# EAGLE schematic canable_candapter (EAGLE 9.4.2)
Therm
CNAME: CANable USB<=>CAN; CREVISION: 0.1; DESIGNER: Ethan Zonca
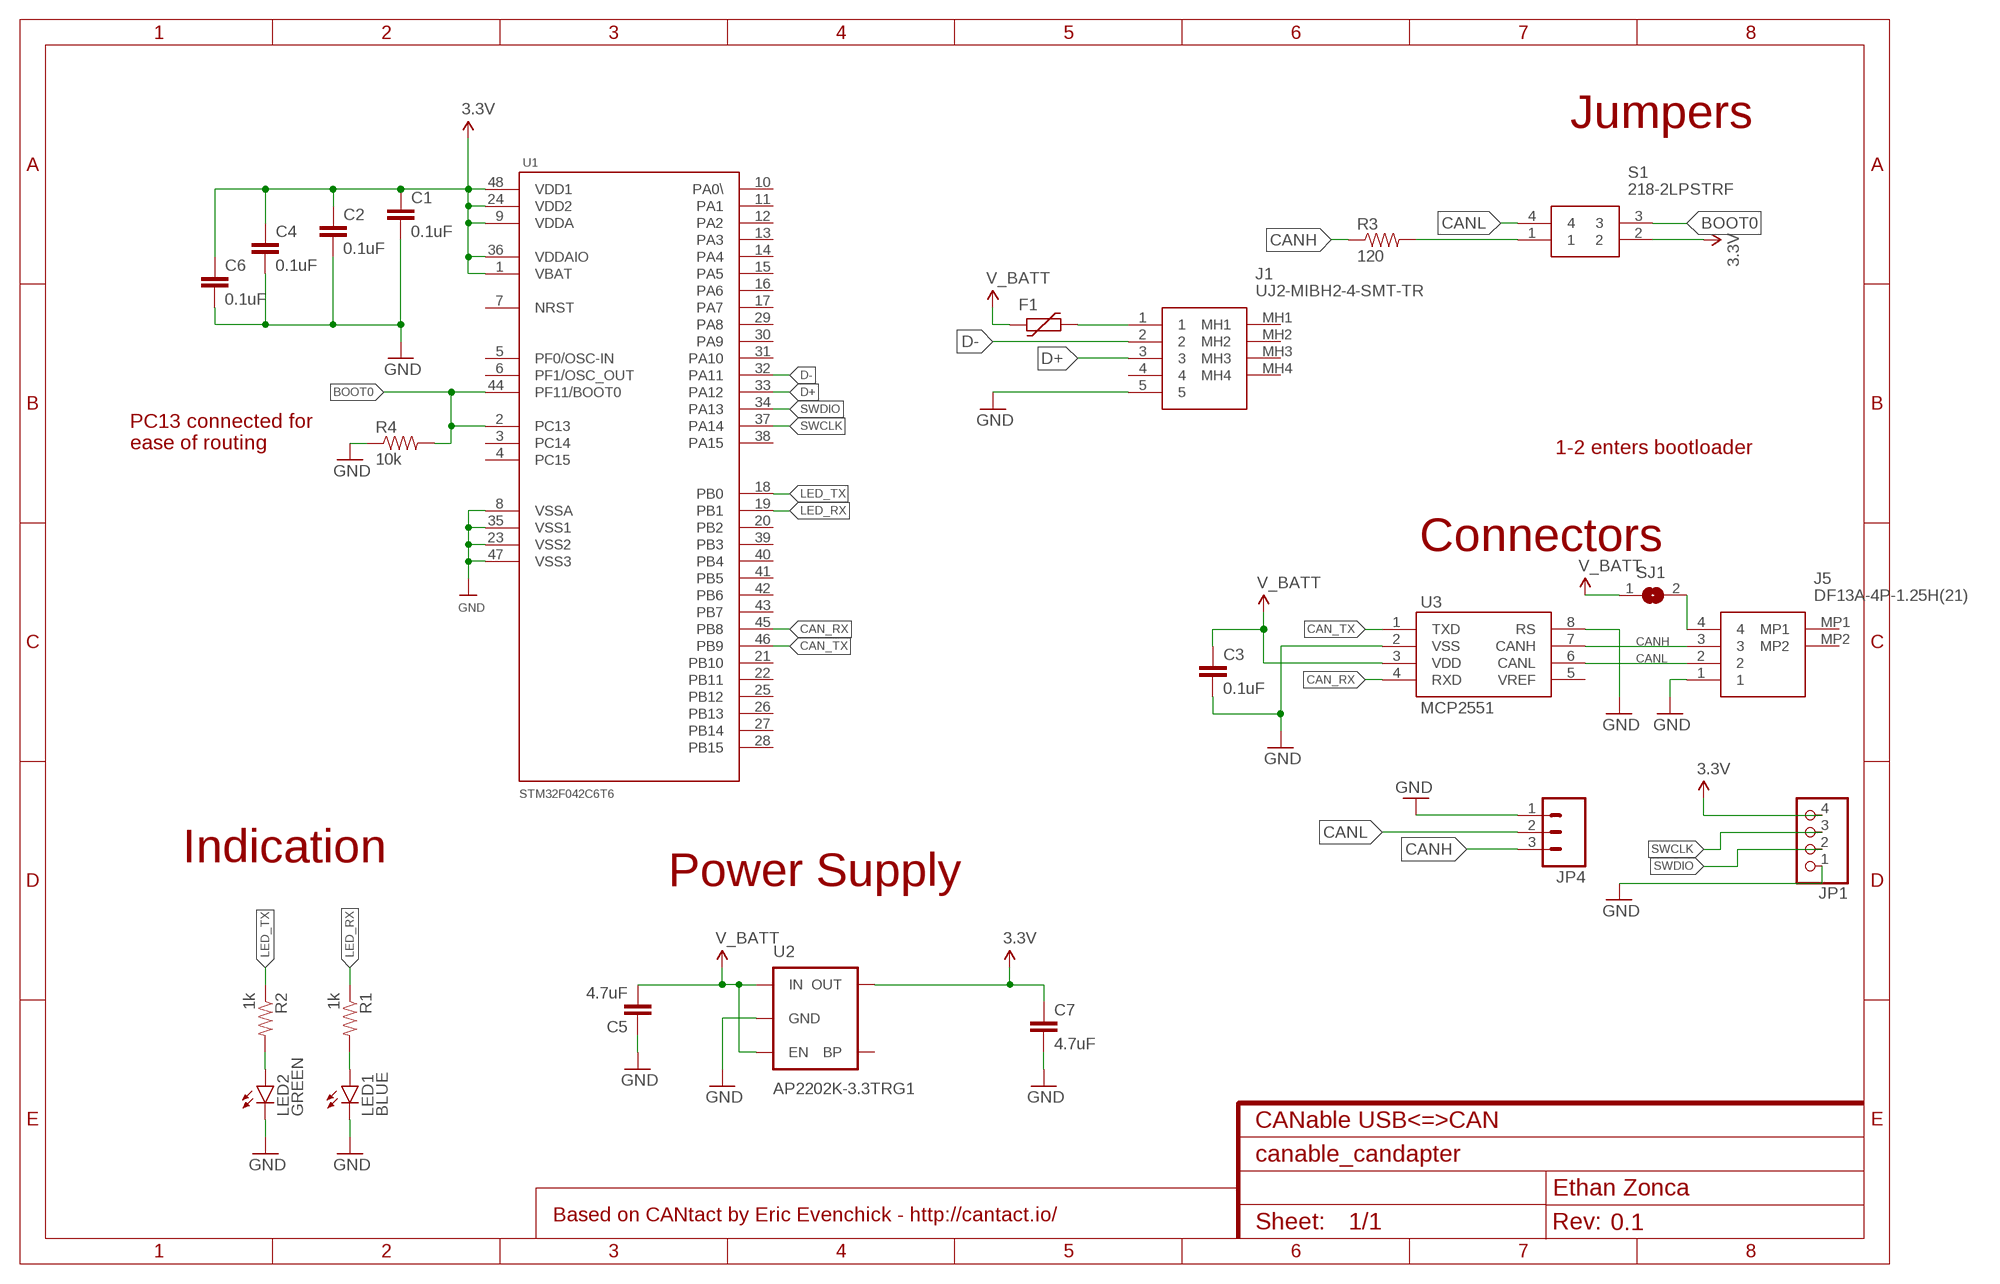
[diagram p0: schematic, sheet 1]

## Parts
C1  0.1uF  CAP0603-CAP  [0603-CAP]
C2  0.1uF  CAP0603-CAP  [0603-CAP]
C3  0.1uF  CAP0603-CAP  [0603-CAP]
C4  0.1uF  CAP0603-CAP  [0603-CAP]
C5  4.7uF  CAP0603-CAP  [0603-CAP]
C6  0.1uF  CAP0603-CAP  [0603-CAP]
C7  4.7uF  CAP0603-CAP  [0603-CAP]
F1  FUSE_PTC-0805  [PTC0805]
J1  UJ2-MIBH2-4-SMT-TR  [UJ2MIBH24SMTTR]
J5  DF13A-4P-1.25H(21)  [DF13A4P125H21]
JP1  PINHD-1X04_2.54-S  [1X04-S]
JP4  M03LOCK  [1X03_LOCK]
LED1  BLUE  LED0603  [LED-0603]
LED2  GREEN  LED0603  [LED-0603]
R1  1k  RESISTOR0603-RES  [0603-RES]
R2  1k  RESISTOR0603-RES  [0603-RES]
R3  120  RESISTOR0603-RES  [0603-RES]
R4  10k  RESISTOR0603-RES  [0603-RES]
S1  218-2LPSTRF  [2182LPSTRF]
SJ1  SJ  [SJ]
U1  STM32F042C6T6  [LQFP48]
U2  AP2202K-3.3TRG1  MIC52053.3V  [SOT23-5]
U3  MCP2551  [SO08]

## Nets
3.3V: C1.1 C2.1 C4.1 C6.1 C7.1 JP1.4 S1.2 U1.1(VBAT) U1.9(VDDA) U1.24(VDD2) U1.36(VDDAIO) U1.48(VDD1) U2.5(OUT)
BOOT0: R4.2 S1.3 U1.2(PC13) U1.44(PF11/BOOT0)
CAN_RX: U1.45(PB8) U3.4(RXD)
CAN_TX: U1.46(PB9) U3.1(TXD)
CANH: J5.3 JP4.3 R3.1 U3.7(CANH)
CANL: J5.2 JP4.2 S1.4 U3.6(CANL)
D+: J1.3 U1.33(PA12)
D-: J1.2 U1.32(PA11)
GND: C1.2 C2.2 C3.2 C4.2 C5.1 C6.2 C7.2 J1.5 J5.1 JP1.1 JP4.1 LED1.C LED2.C R4.1 U1.8(VSSA) U1.23(VSS2) U1.35(VSS1) U1.47(VSS3) U2.2(GND) U3.2(VSS) U3.8(RS)
LED_RX: R1.1 U1.19(PB1)
LED_TX: R2.1 U1.18(PB0)
N$2: LED2.A R2.2
N$3: R3.2 S1.1
N$5: J5.4 SJ1.2
N$7: F1.2 J1.1
N$23: LED1.A R1.2
SWCLK: JP1.3 U1.37(PA14)
SWDIO: JP1.2 U1.34(PA13)
V_BATT: C3.1 C5.2 F1.1 SJ1.1 U2.1(IN) U2.3(EN) U3.3(VDD)
Unconnected: J1.4 J1.MH1 J1.MH2 J1.MH3 J1.MH4 J5.MP1 J5.MP2 U1.3(PC14) U1.4(PC15) U1.5(PF0/OSC-IN) U1.6(PF1/OSC_OUT) U1.7(NRST) U1.10(PA0\) U1.11(PA1) U1.12(PA2) U1.13(PA3) U1.14(PA4) U1.15(PA5) U1.16(PA6) U1.17(PA7) U1.20(PB2) U1.21(PB10) U1.22(PB11) U1.25(PB12) U1.26(PB13) U1.27(PB14) U1.28(PB15) U1.29(PA8) U1.30(PA9) U1.31(PA10) U1.38(PA15) U1.39(PB3) U1.40(PB4) U1.41(PB5) U1.42(PB6) U1.43(PB7) U2.4(BP) U3.5(VREF)

## Notes on the sheet
- Jumpers
- 1-2 enters bootloader
- PC13 connected for
  ease of routing
- Connectors
- Indication
- Power Supply
- Based on CANtact by Eric Evenchick - http://cantact.io/

## Library data of the parts
C1-C7 = SparkFun-Passives:CAP: Capacitor Standard 0603 ceramic capacitor, and 0.1" leaded capacitor.
F1 = dp_devices:FUSE_PTC: Resettable PTC
J1 = SamacSys_Parts:UJ2-MIBH2-4-SMT-TR: CONN RCPT USB2.0 MICRO B SMD R/A Source: Datasheet <https://www.cui.com/product/resource/digikeypdf/uj2-mibh2-4-smt.pdf>; ARROW_PART_NUMBER: UJ2-MIBH2-4-SMT-TR; ARROW_PRICE-STOCK: https://www.arrow.com/en/products/uj2-mibh2-4-smt-tr/cui-devices; DESCRIPTION: CONN RCPT USB2.0 MICRO B SMD R/A; HEIGHT: 2.5mm; MANUFACTURER_NAME: CUI Devices; MANUFACTURER_PART_NUMBER: UJ2-MIBH2-4-SMT-TR; MOUSER_PART_NUMBER: 490-UJ2-MIBH2-4-SMT; MOUSER_PRICE-STOCK: https://www.mouser.co.uk/ProductDetail/CUI-Devices/UJ2-MIBH2-4-SMT-TR?qs=5mqXD9RfOg1yxHIpPvPxvQ%3D%3D
J5 = SamacSys_Parts:DF13A-4P-1.25H(21): Headers & Wire Housings 4P SNG ROW PIN HDR R/A SMT Source: Datasheet <https://componentsearchengine.com/Datasheets/1/DF13A-4P-1.25H(21).pdf>; DESCRIPTION: Headers & Wire Housings 4P SNG ROW PIN HDR R/A SMT; HEIGHT: 3.6mm; MANUFACTURER_NAME: Hirose; MANUFACTURER_PART_NUMBER: DF13A-4P-1.25H(21); MOUSER_PART_NUMBER: 798-DF13A4P125H21; MOUSER_PRICE-STOCK: https://www.mouser.com/Search/Refine.aspx?Keyword=798-DF13A4P125H21; RS_PART_NUMBER: 1886349; RS_PRICE-STOCK: http://uk.rs-online.com/web/p/products/1886349
JP1 = pinhead-2:PINHD-1X04: PIN HEADER
JP4 = SparkFun-Connectors:M03: Header 3 Standard 3-pin 0.1" header. Use with straight break away headers (SKU : PRT-00116), right angle break away headers (PRT-00553), swiss pins (PRT-00743), machine pins (PRT-00117), and female headers (PRT-00115). Molex polarized connector foot print use with SKU : PRT-08232 with associated crimp pins and housings.
LED1 LED2 = SparkFun-LED:LED: LEDs Standard schematic elements and footprints for 5mm, 3mm, 1206, and 0603 sized LEDs. 5mm - Spark Fun Electronics SKU : COM-00529 (and others)
R1-R4 = SparkFun-Passives:RESISTOR: Resistor Basic schematic elements and footprints for 0603, 1206, and PTH resistors.
S1 = SamacSys_Parts:218-2LPSTRF: SWITCH SLIDE DIP SPST 25MA 24V Source: Datasheet <https://www.ctscorp.com/wp-content/uploads/218.pdf>; DESCRIPTION: SWITCH SLIDE DIP SPST 25MA 24V; HEIGHT: 2.65mm; MANUFACTURER_NAME: CTS; MANUFACTURER_PART_NUMBER: 218-2LPSTRF; MOUSER_PART_NUMBER: 774-218-2LPSTRF; MOUSER_PRICE-STOCK: https://www.mouser.co.uk/ProductDetail/CTS-Electronic-Components/218-2LPSTRF?qs=6E8igxPflKfid29mp1Rq8Q%3D%3D
SJ1 = jumper:SJ: SMD solder JUMPER
U1 = Protofusion:STM32F042C6T6
U2 = SparkFun-PowerIC:MIC5205: MIC5205 150mA vreg 3.3V - VREG-00822 5V - VREG-00823; PROD_ID: VREG-00822
U3 = SparkFun-DigitalIC:MCP2551: CAN transceiver; PROD_ID: IC-09907